# EasyEDA Pro project ProProject_STM32F407IGT6_2024-02-27.epro, board PCB3
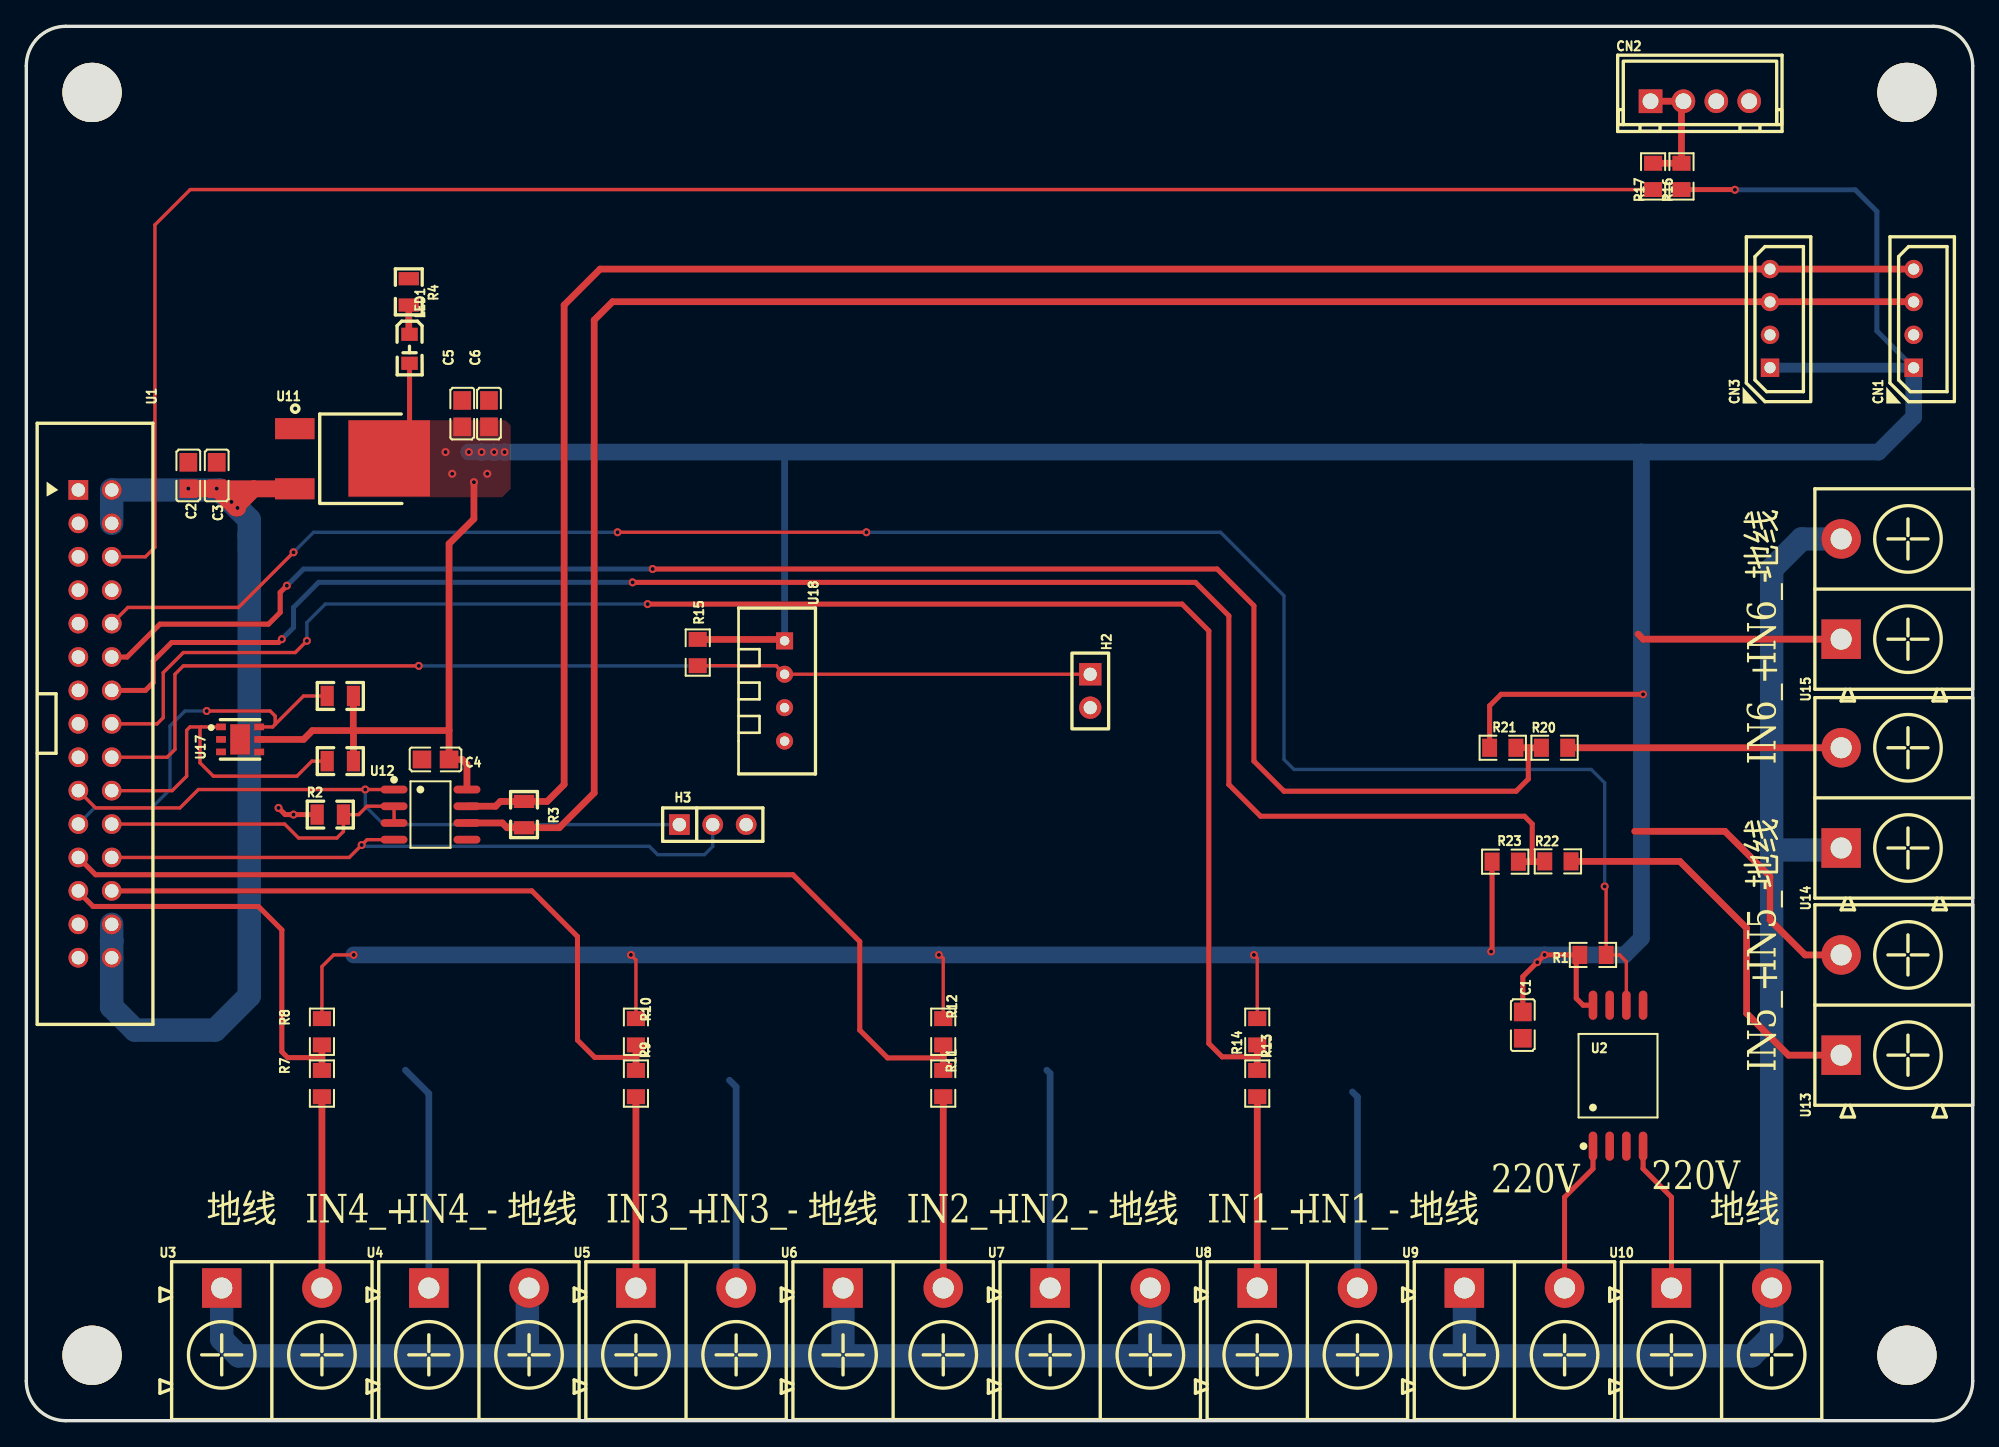
[diagram p8: board, top side]
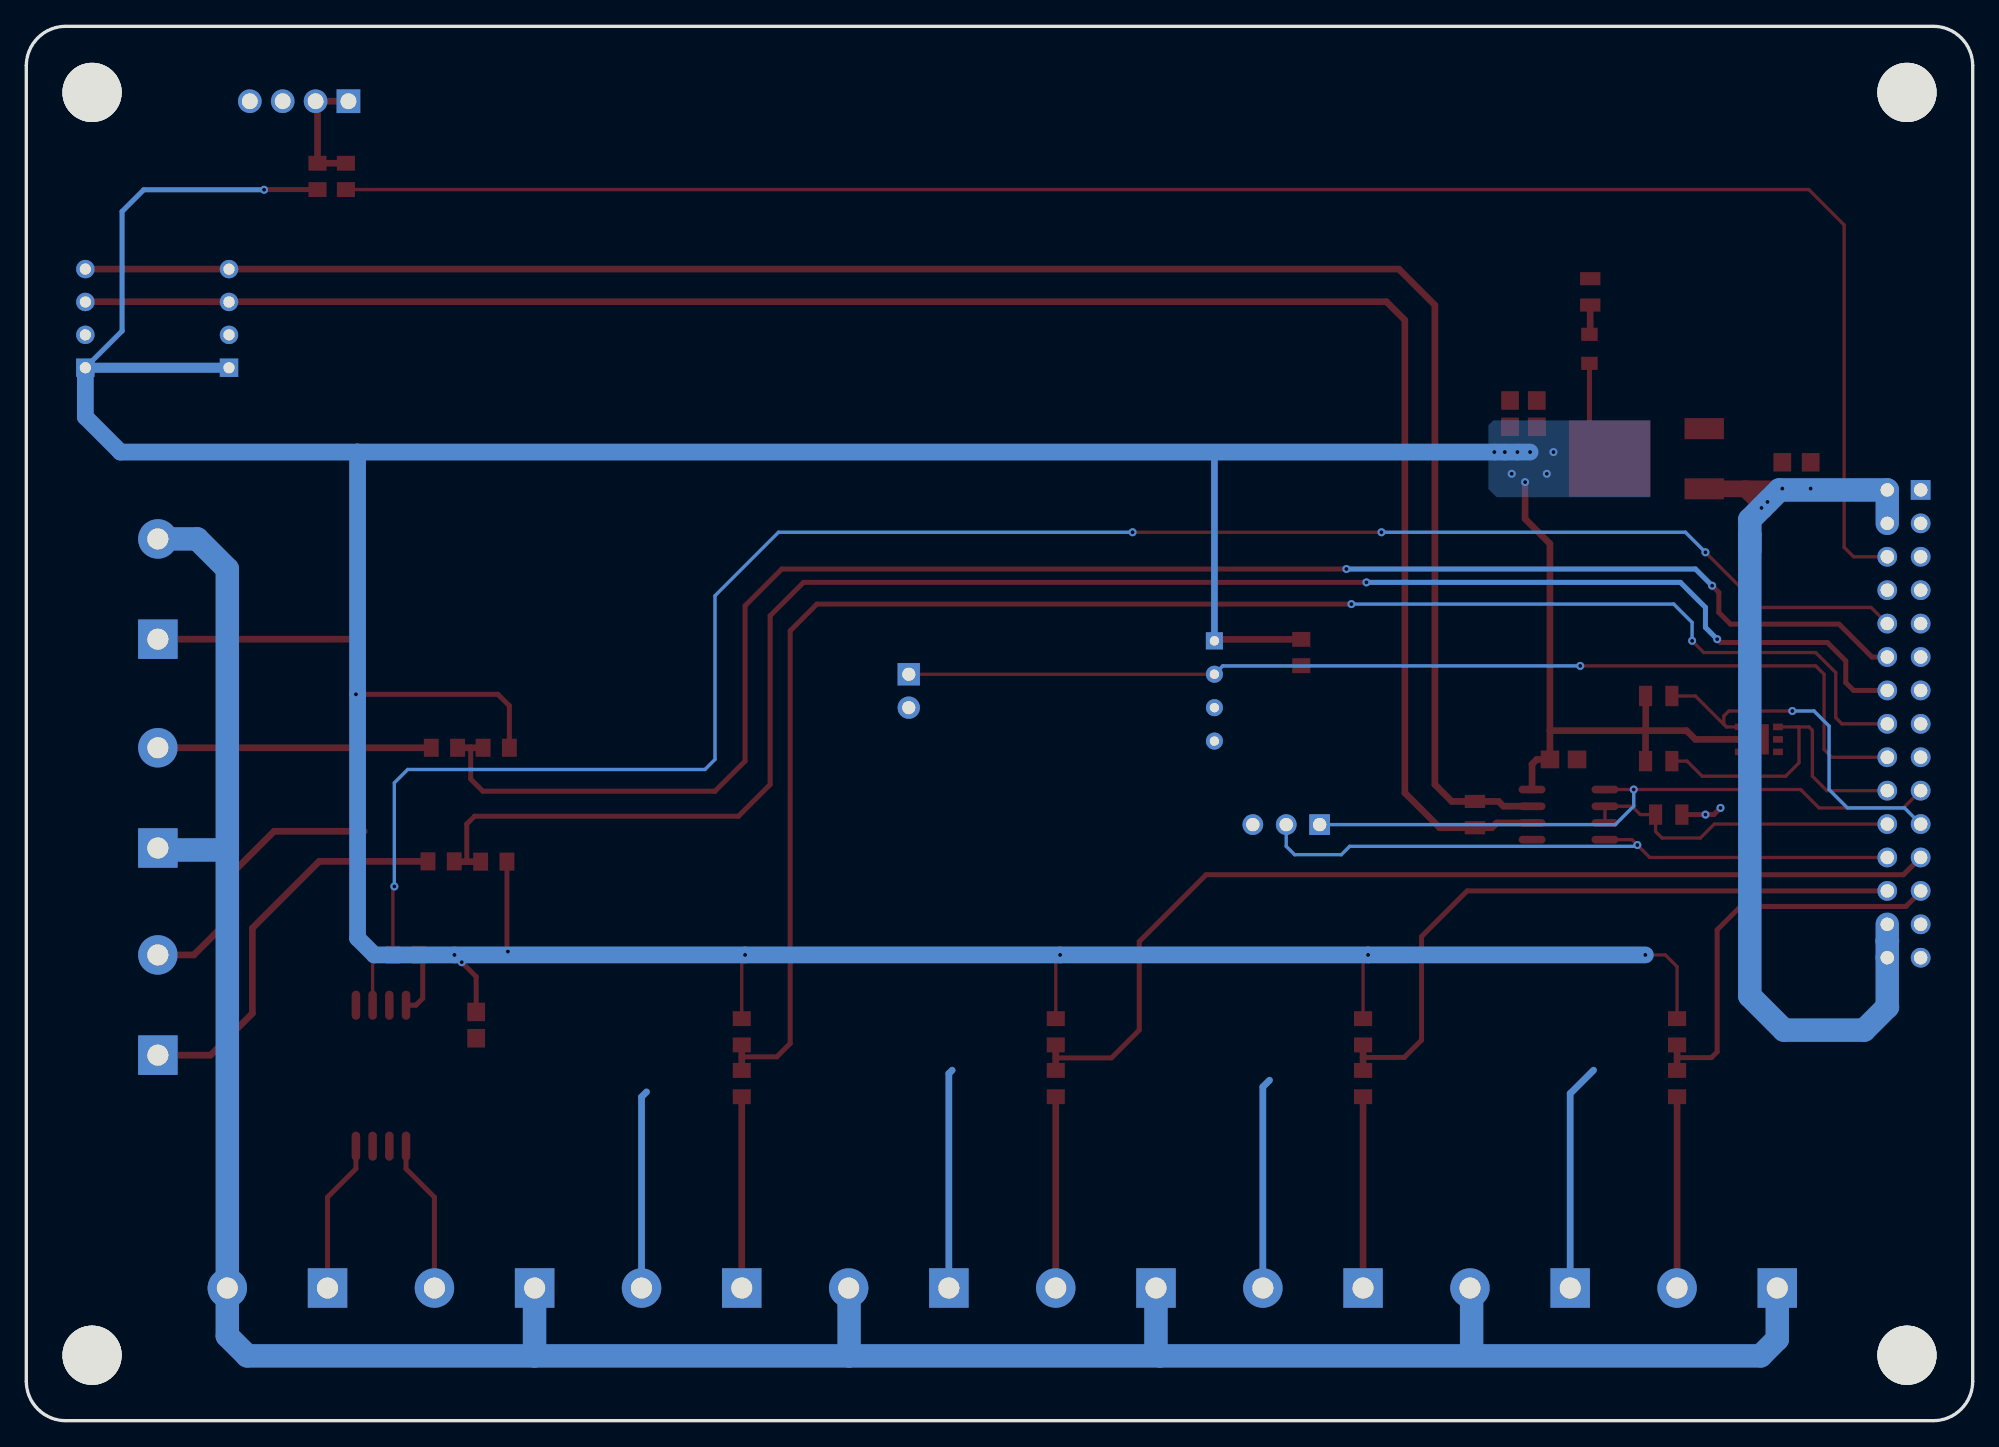
[diagram p9: board, bottom side, seen from below]

Outline 148 x 106 mm; copper layers: Top Layer, Bottom Layer. Coordinates in mm from the lower left corner of the outline.
Outline path: 0,103 0,3 arc(0.88,0.88) 3,0 145,0 arc(147.12,0.88) 148,3 148,103 arc(147.12,105.12) 145,106 3,106 arc(0.88,105.12) 0,103
Stack: Top Layer 0.035mm / Dielectric1 1.51mm FR4 er 4.5 / Bottom Layer 0.035mm

## Design rules (mm)
template: JLCPCB Capability(Two Layers Board)
spacing copperThickness1oz (default): track to track 0.102, other pairs 0.152 to 0.3
spacing copperThickness2oz: track to track 0.203, other pairs 0.152 to 0.3
track width copperThickness1oz (default): min 0.127, default 0.254, max 2.54
track width copperThickness2oz: min 0.203, default 0.254, max 2.54
differential pair differentialPair (default): width min 0.127, default 0.254, max 2.54; gap min 0.152, default 0.152
via viaSize (default): diameter min 0.5, default 0.61, max 10; hole min 0.3, default 0.305, max 6.3

## Placement (name value [footprint] x y rotation side)
C1  100nF  [C0805]  113.79 30.07 270 top
C2  100nF  [C0805]  12.32 71.86 90 top
C3  100nF  [C0805]  14.48 71.86 90 top
C4  104  [C0805#2]  31.11 50.27 180 top
C5  100nF  [C0805]  33.15 76.56 270 top
C6  100nF  [C0805]  35.18 76.56 270 top
CN1  HC-5264-4A  [CONN-TH_4P-P2.50_HCTL_HC-5264-4A]  143.51 83.79 90 top
CN2  XH-4AK  [CONN-TH_XH-4AK]  127.25 100.3 0 top
CN3  HC-5264-4A  [CONN-TH_4P-P2.50_HCTL_HC-5264-4A]  132.59 83.79 90 top
H2  -  [HDR-TH_2P-P2.54-V-F]  80.9 55.47 270 top
H3  -  [HDR-TH_3P-P2.54-V-F]  52.2 45.31 0 top
LED1  -  [LED0805-RD_RED]  29.14 81.48 270 top
NOREF  -  [Pad_ie991]  5 100.97 0 top
NOREF#2  -  [Pad_ie984]  143 4.97 0 top
NOREF#3  -  [Pad_ie986]  143 100.97 0 top
NOREF#4  -  [Pad_ie994]  5 4.97 0 top
R1  10K  [R0805#2]  119.13 35.41 180 top
R2  10K  [R0805]  23.11 46.08 0 top
R3  120  [R0805]  37.85 46.08 90 top
R4  1K  [R0805]  29.08 85.81 90 top
R5  10k  [R0805]  23.88 50.14 0 top
R6  10k  [R0805]  23.88 55.09 0 top
R7  100  [R0805#2]  22.48 25.63 270 top
R8  10K  [R0805#2]  22.48 29.57 90 top
R9  100  [R0805#2]  46.35 25.63 270 top
R10  10K  [R0805#2]  46.35 29.57 90 top
R11  100  [R0805#2]  69.72 25.63 270 top
R12  10K  [R0805#2]  69.72 29.57 90 top
R13  100  [R0805#2]  93.6 25.63 270 top
R14  10K  [R0805#2]  93.6 29.57 90 top
R15  10K  [R0805#2]  51.05 58.39 90 top
R16  47K  [R0805#2]  125.86 94.59 270 top
R17  1K  [R0805#2]  123.7 94.59 270 top
R20  100  [R0805#2]  116.2 51.16 0 top
R21  10K  [R0805#2]  112.27 51.16 180 top
R22  100  [R0805#2]  116.46 42.52 0 top
R23  10K  [R0805#2]  112.45 42.5 180 top
U1  ZX-IDC2.54-2-15PZZ  [IDC-TH_30P-P2.54_ZX-IDC2.54-2-15PZZ]  5.23 52.97 270 top
U2  ACPL-K370-500E  [SO-8_L5.9-W6.8-P1.27-LS11.5-BL]  121.03 26.23 0 top
U3  KF7.62-2P  [CONN-TH_2P-P7.62_KEFA_KF7.62-2P]  18.67 10.09 0 top
U4  KF7.62-2P  [CONN-TH_2P-P7.62_KEFA_KF7.62-2P]  34.42 10.09 0 top
U5  KF7.62-2P  [CONN-TH_2P-P7.62_KEFA_KF7.62-2P]  50.16 10.08 0 top
U6  KF7.62-2P  [CONN-TH_2P-P7.62_KEFA_KF7.62-2P]  65.91 10.08 0 top
U7  KF7.62-2P  [CONN-TH_2P-P7.62_KEFA_KF7.62-2P]  81.66 10.08 0 top
U8  KF7.62-2P  [CONN-TH_2P-P7.62_KEFA_KF7.62-2P]  97.41 10.08 0 top
U9  KF7.62-2P  [CONN-TH_2P-P7.62_KEFA_KF7.62-2P]  113.16 10.08 0 top
U10  KF7.62-2P  [CONN-TH_2P-P7.62_KEFA_KF7.62-2P]  128.91 10.08 0 top
U11  UZ1085L-33-TN3-R  [TO-252-2_L6.6-W6.1-P4.58-TL]  24 73.13 0 top
U12  MAX3485EESA+T  [SOIC-8_L4.9-W3.9-P1.27-LS6.0-BL]  30.73 46.08 270 top
U13  KF7.62-2P  [CONN-TH_2P-P7.62_KEFA_KF7.62-2P]  138 31.6 90 top
U14  KF7.62-2P  [CONN-TH_2P-P7.62_KEFA_KF7.62-2P]  138 47.35 90 top
U15  KF7.62-2P  [CONN-TH_2P-P7.62_KEFA_KF7.62-2P]  138 63.22 90 top
U17  SHT20-TR-1.5KS  [DFN-6_L3.0-W3.0-P0.95-TR-EP]  16.26 51.79 90 top
U18  DHT11  [SENSOR-TH_DHT11]  57.66 55.47 270 top

## Footprints (pads in the part's own frame, mm; a bottom-side part is the same pattern mirrored in y, then rotated)
C0805
  rect 1.41x1.35 smd: 1(-1,0) 2(1,0)
C0805#2
  rect 1.41x1.35 smd: 1(-1.03,0) 2(1.03,0)
CONN-TH_2P-P7.62_KEFA_KF7.62-2P
  rect 3x3 hole 1.6: 1(-3.81,0)
  round 3 hole 1.6: 2(3.81,0)
CONN-TH_4P-P2.50_HCTL_HC-5264-4A
  rect 1.4x1.4 hole 0.85: 1(-3.75,0)
  round 1.4 hole 0.85: 2(-1.25,0) 3(1.25,0) 4(3.75,0)
CONN-TH_XH-4AK
  rect 1.8x1.8 hole 1.2: 1(-3.75,0)
  round 1.8 hole 1.2: 2(-1.25,0) 3(1.25,0) 4(3.75,0)
DFN-6_L3.0-W3.0-P0.95-TR-EP
  rect 0.5x0.75 smd: 1(0.95,1.452) 2(0,1.451) 3(-0.95,1.45) 4(-0.95,-1.452) 5(0,-1.452) 6(0.95,-1.451)
  rect 2.3x1.5 smd: 7(0.004,-0.001)
HDR-TH_2P-P2.54-V-F
  rect 1.7x1.7 hole 1: 1(-1.27,0)
  round 1.7 hole 1: 2(1.27,0)
HDR-TH_3P-P2.54-V-F
  rect 1.575x1.575 hole 1.02: 1(-2.54,0)
  round 1.575 hole 1.02: 2(0,0) 3(2.54,0)
IDC-TH_30P-P2.54_ZX-IDC2.54-2-15PZZ
  rect 1.5x1.5 hole 1.02: 1(-17.78,-1.27)
  round 1.5 hole 1.02: 2(-17.78,1.27) 3(-15.24,-1.27) 4(-15.24,1.27) 5(-12.7,-1.27) 6(-12.7,1.27) 7(-10.16,-1.27) 8(-10.16,1.27) 9(-7.62,-1.27) 10(-7.62,1.27) 11(-5.08,-1.27) 12(-5.08,1.27) 13(-2.54,-1.27) 14(-2.54,1.27) 15(0,-1.27) 16(0,1.27) 17(2.54,-1.27) 18(2.54,1.27) 19(5.08,-1.27) 20(5.08,1.27) 21(7.62,-1.27) 22(7.62,1.27) 23(10.16,-1.27) 24(10.16,1.27) 25(12.7,-1.27) 26(12.7,1.27) 27(15.24,-1.27) 28(15.24,1.27) 29(17.78,-1.27) 30(17.78,1.27)
LED0805-RD_RED
  rect 1x1.25 smd: 1(-1.1,0) 2(1.1,0)
Pad_ie984
  round 4.5 hole 4.5: 4(0,0)
Pad_ie986
  round 4.5 hole 4.5: 4(0,0)
Pad_ie991
  round 4.5 hole 4.5: 4(0,0)
Pad_ie994
  round 4.5 hole 4.5: 4(0,0)
R0805
  rect 1x1.55 smd: 1(-1,0) 2(1,0)
R0805#2
  rect 1.133x1.377 smd: 1(-1,0) 2(1,0)
SENSOR-TH_DHT11
  rect 1.296x1.296 hole 0.711: 1(-3.81,0)
  round 1.296 hole 0.711: 2(-1.27,0) 3(1.27,0) 4(3.81,0)
SO-8_L5.9-W6.8-P1.27-LS11.5-BL
  oval 0.65x2.216 smd: 1(-1.905,-5.359) 2(-0.635,-5.359) 3(0.635,-5.359) 4(1.905,-5.359) 5(1.905,5.359) 6(0.635,5.359) 7(-0.635,5.359) 8(-1.905,5.359)
SOIC-8_L4.9-W3.9-P1.27-LS6.0-BL
  oval 0.588x2.045 smd: 1(-1.905,-2.772) 2(-0.635,-2.772) 3(0.635,-2.772) 4(1.905,-2.772) 5(1.905,2.772) 6(0.635,2.772) 7(-0.635,2.772) 8(-1.905,2.772)
TO-252-2_L6.6-W6.1-P4.58-TL
  rect 2.999x1.6 smd: 1(-3.59,2.286) 3(-3.59,-2.286)
  rect 6.2x5.8 smd: 2(3.59,0.025)

## Nets
As in the schematic.

Pads without a net: NOREF 4; NOREF#2 4; NOREF#3 4; NOREF#4 4; U2 2 3 7; U3 1; U4 2; U6 1; U7 2; U9 1; U10 2; U14 1; U15 2; U17 3 4; U18 3

## Via types
v1: diameter 0.61, hole 0.305, Top Layer to Bottom Layer, 37 vias

## Routing (per net, layer and track width the routed paths; a pad name or vN(x,y) marks a point on that pad's centre or on a via; arc(x,y) is an arc through that point)
+3V3: length 420.7
  Top Layer w0.254: R10.2 46.35,35.03 v1(45.97,35.41) ; R8.2 22.48,34.52 23.37,35.41 v1(24.89,35.41) ; R14.2 93.6,35.15 v1(93.34,35.41) ; R12.2 69.72,35.15 69.47,35.41
  Top Layer w0.381: R16.2 129.91,93.59 v1(129.92,93.57) ; U2.8 118.38,31.58 117.86,32.11 117.86,35.14 R1.2 v1(115.44,35.41) v1(114.89,34.85) 113.79,33.76 C1.1 ; v1(111.38,35.66) 111.45,35.74 R23.2 ; LED1.2 29.14,74.7 U11.2 ; v1(122.94,55.22) 112.14,55.22 111.27,54.35 R21.2
  Top Layer w0.508: U12.8 33.51,49.91 33.15,50.27 C4.1 32.14,52.46 ; v1(34.04,71.35) 34.04,68.55 32.14,66.66 32.14,52.46 ; R15.2 57.55,59.39 U18.1 ; 25,55.09 24.86,54.95 24.86,52.46 ; U17.5 21.08,51.79 21.75,52.46 24.86,52.46 ; R5.2 24.88,52.44 24.86,52.46 ; 24.86,52.46 32.14,52.46
  Bottom Layer w0.254: v1(122.94,55.22) 122.92,55.24 122.81,55.24
  Bottom Layer w0.381: v1(129.92,93.57) 139.06,93.57 140.72,91.92 140.72,82.84 CN1.1 ; v1(114.89,34.85) v1(115.44,35.41)
  Bottom Layer w0.508: U18.1 57.66,73.59
  Bottom Layer w0.762: CN1.1 CN3.1
  Bottom Layer w1.27: 122.82,73.63 140.84,73.63 143.51,76.3 CN1.1 ; 122.82,73.63 122.81,73.62 122.81,36.68 121.54,35.41 v1(115.44,35.41) v1(93.34,35.41) v1(69.39,35.41) v1(45.97,35.41) v1(24.89,35.41) ; 122.82,73.63 v1(36.37,73.63) v1(35.58,73.63) v1(34.62,73.63) v1(33.65,73.63)
  vias: v1(31.88,73.63) v1(32.38,71.98) v1(35.05,71.98)
+5V: length 87.4
  Top Layer w0.254: 14.6,70.84 14.59,70.86 v1(14.48,70.86) ; v1(15.6,69.84) v1(16.06,69.39)
  Top Layer w1.27: 14.6,70.84 v1(15.6,69.84) 16.15,69.84 16.06,69.75 16.06,69.6 ; 14.6,70.84 14.48,70.84 ; 14.6,70.84 17.3,70.84 ; 14.48,70.84 v1(14.48,70.86) v1(12.32,70.86) 12.33,70.84 14.48,70.84 ; 14.48,70.84 15.93,69.39 v1(16.06,69.39) 16.06,69.6 ; 17.3,70.84 16.06,69.6 ; 17.3,70.84 20.41,70.84
  Bottom Layer w1.778: 6.5,31.45 U1.30 6.5,36.46 ; 6.5,31.45 8.25,29.69 14.35,29.69 16.95,32.29 16.95,67.35 ; 6.5,31.45 6.48,31.47 ; 16.95,67.35 16.95,66.14 ; 16.95,67.35 16.95,68.5 v1(16.06,69.39) v1(15.6,69.84) 14.69,70.75 6.5,70.75 U1.4 ; 6.48,36.44 6.5,36.46 ; 6.5,36.46 6.5,37.73
GND: length 105.3
  Top Layer w0.381: R2.1 v1(20.32,46.08) 19.68,46.08 v1(19.18,46.58)
  Top Layer w0.508: U13.2 135.25,35.41 132.59,38.07 132.59,41.38 129.16,44.81 122.3,44.81 ; U15.1 122.94,59.41 122.56,59.79
  Bottom Layer w0.508: U7.1 77.85,26.39 77.6,26.64 ; U5.2 53.97,25.37 53.47,25.88 ; 28.83,26.64 30.61,24.87 U4.1 ; 100.84,24.99 101.22,24.61 U8.2
(no net): length 213.3
  Bottom Layer w1.778: 132.72,43.39 U10.2 132.72,6.45 131.19,4.93 109.35,4.93 ; 132.72,43.39 137.85,43.39 U14.1 ; 132.72,43.39 132.72,64.74 135,67.03 U15.2 ; 85.44,4.93 109.35,4.93 ; 85.44,4.93 85.44,10.05 U7.2 ; 85.44,4.93 61.81,4.93 ; 109.35,4.93 109.35,10.08 U9.1 ; U6.1 62.1,5.22 61.81,4.93 ; 61.81,4.93 16.13,4.93 14.86,6.2 U3.1 ; U4.2 38.1,9.96 38.1,5.18
220_INT: length 149.8
  Top Layer w0.254: 6.5,60.59 7.73,61.82 16.13,61.82 v1(20.32,66.01) ; U2.6 121.67,34.9 121.16,35.41 R1.1 120.13,40.5 v1(120.01,40.61) ; v1(63.88,67.54) v1(44.96,67.54)
  Bottom Layer w0.254: v1(63.88,67.54) 90.81,67.54 95.63,62.71 95.63,50.27 96.39,49.5 119,49.5 120.01,48.49 v1(120.01,40.61) ; v1(44.96,67.54) 21.84,67.54 v1(20.32,66.01)
220_L: length 11.7
  Top Layer w0.381: U10.1 125.09,16.99 122.94,19.15 U2.4
220_N: length 11.7
  Top Layer w0.381: U9.2 116.97,16.99 119.13,19.15 U2.1
485A_SLAVE: length 147.8
  Top Layer w0.508: U12.6 36.19,45.44 36.56,45.08 R3.1 40.53,45.08 43.18,47.73 43.18,83.67 44.58,85.06 143.49,85.06 CN1.3
485B_SLAVE: length 148.3
  Top Layer w0.508: CN1.4 43.63,87.54 40.89,84.81 40.89,48.36 39.61,47.08 R3.2 36.05,47.08 35.69,46.71 33.51,46.71
485SLAVE: length 24.9
  Top Layer w0.254: U12.3 27.96,46.71 25.91,46.71 25.27,46.08 R2.2 24.11,44.79 23.62,44.3 20.7,44.3 19.64,45.35 U1.22
DHT11_DATA: length 87.8
  Top Layer w0.254: U1.18 10.71,50.43 11.3,51.03 11.3,56.74 11.94,57.38 v1(29.84,57.38) ; H2.1 U18.2 57.01,57.39 R15.1
  Bottom Layer w0.254: U18.2 57.02,57.38 v1(29.84,57.38)
I2C2_SCL: length 28.4
  Top Layer w0.254: v1(13.72,53.95) 18.54,53.95 18.92,53.57 18.92,52.93 ; 18.92,52.93 18.73,52.74 U17.6 ; 18.92,52.93 21.08,55.09 23,55.09
  Bottom Layer w0.254: U1.21 5.19,46.58 9.52,46.58 10.92,47.98 10.92,52.81 12.06,53.95 v1(13.72,53.95)
I2C2_SDA: length 25.7
  Top Layer w0.254: 13.29,52.74 12.45,52.74 12.19,52.49 12.19,49 11.09,47.89 6.5,47.89 ; 13.29,52.74 13.21,52.66 13.21,50.01 14.22,49 20.57,49 21.72,50.14 R5.1 ; 13.29,52.74 U17.1
IN1_+: length 14.5
  Top Layer w0.508: 93.6,9.94 93.6,24.48
IN2_+: length 14.5
  Top Layer w0.508: 69.72,10.01 69.72,24.56
IN3_+: length 14.5
  Top Layer w0.508: U5.1 R9.2
IN4_+: length 14.5
  Top Layer w0.508: U3.2 R7.2
IN5_+: length 30.4
  Top Layer w0.508: R22.2 125.73,42.52 130.81,37.44 130.81,30.96 133.98,27.79 U13.1
IN6_+: length 20.8
  Top Layer w0.508: U14.2 R20.2
LIGHT_SENSOR: length 143.1
  Top Layer w0.254: 6.5,65.67 9.06,65.67 9.78,66.4 9.78,90.91 12.46,93.59 R17.2
PA0: length 51.7
  Top Layer w0.381: U1.26 38.44,40.27 41.91,36.8 41.91,28.93 43.22,27.62 46.35,27.62
  Top Layer w0.508: R10.1 R9.1
PA1: length 31.2
  Top Layer w0.381: U1.25 3.96,40.21 5.08,39.09 17.65,39.09 19.43,37.31 19.43,28.04 19.87,27.6 22.48,27.6
  Top Layer w0.508: R7.1 R8.1
PA2: length 50.9
  Top Layer w0.254: 6.5,42.81 24.55,42.81 v1(25.5,43.76) 25.91,44.17 U12.4
  Bottom Layer w0.254: v1(25.5,43.76) 25.6,43.66 47.37,43.66 48.01,43.03 51.56,43.03 52.2,43.66 H3.2
PA3: length 50.9
  Top Layer w0.254: 3.96,47.89 5.27,46.58 11.68,46.58 13.08,47.98 v1(25.77,47.98) U12.1
  Bottom Layer w0.254: v1(25.77,47.98) 25.77,46.72 27.18,45.31 H3.1
PA6: length 128.3
  Top Layer w0.254: U1.16 9.95,52.97 10.41,53.44 10.41,56.87 11.94,58.39 20.45,58.39 v1(21.34,59.28)
  Top Layer w0.381: 93.6,27.66 90.93,27.66 89.92,28.68 89.92,60.05 87.88,62.08 v1(47.24,62.08)
  Top Layer w0.508: 93.6,26.48 93.6,28.42
  Bottom Layer w0.254: v1(47.24,62.08) 22.73,62.08 21.34,60.68 v1(21.34,59.28)
PB0: length 130
  Top Layer w0.381: v1(19.81,63.47) 19.3,62.97 19.3,61.44 18.41,60.55 10.16,60.55 7.66,58.05 U1.12 ; v1(47.62,64.74) 90.55,64.74 93.34,61.95 93.34,50.14 95.63,47.85 113.28,47.85 114.21,48.78 114.21,51.16
  Top Layer w0.508: R21.1 R20.1
  Bottom Layer w0.381: v1(47.62,64.74) 21.08,64.74 v1(19.81,63.47)
PC4: length 133.3
  Top Layer w0.381: v1(46.1,63.73) 88.9,63.73 91.44,61.19 91.44,48.36 93.85,45.95 113.92,45.95 114.51,45.36 114.51,42.5 ; 6.5,55.51 9.06,55.51 9.65,56.11 9.65,57.76 11.05,59.16 19.18,59.16 v1(19.43,59.41)
  Top Layer w0.508: R23.1 115.43,42.5 R22.1
  Bottom Layer w0.381: v1(46.1,63.73) 22.22,63.73 20.32,61.82 20.32,60.3 v1(19.43,59.41)
PH2: length 78
  Top Layer w0.381: 3.96,42.81 5.27,41.5 58.29,41.5 63.37,36.42 63.37,29.69 65.49,27.58 69.72,27.58
  Top Layer w0.508: 69.72,26.56 69.72,28.49
$1N5460: length 2.3
  Top Layer w0.508: R4.1 29.08,82.64 29.14,82.58
$1N7734: length 9.4
  Top Layer w0.508: R17.1 R16.1 125.86,100.16 CN2.2 CN2.1

## Copper pours and planes (outline as drawn; the poured copper is in the pictures)
+3V3 on Top Layer: 24.51,76.05 36.83,76.05 36.83,70.21 24.51,70.21
+3V3 on Bottom Layer: 24.51,76.05 36.83,76.05 36.83,70.21 24.51,70.21
GND on Top Layer: -1.91,122.66 145.41,122.66 167.13,100.94 167.13,3.78 152.65,-10.69 -9.27,-10.69 -9.27,115.29
GND on Bottom Layer: 2.41,125.32 149.73,125.32 171.45,103.61 171.45,6.45 156.97,-8.03 -4.95,-8.03 -4.95,117.96

## Text on the board
Top Silkscreen Layer: 地线 | IN4_+ | IN4_- | IN3_+ | IN3_- | IN2_+ | IN2_- | IN1_+ | IN1_- | 220V | IN6_- | IN6_+ | IN5_- | IN5_+ | 温湿度 / 光敏 / 断电 / 箱体门 | 传感器线 | 光敏
